# Altium project lvc07a.PrjPcb
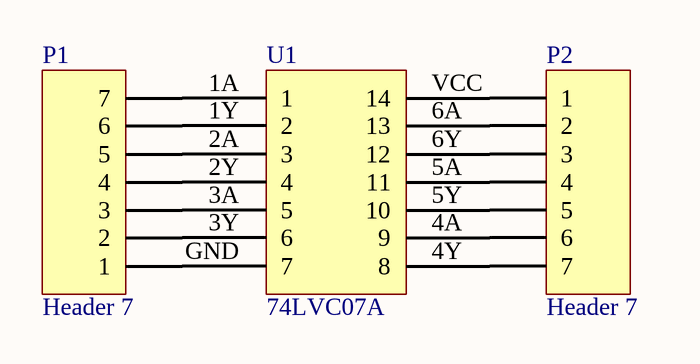
[diagram p0: Sheet1.SchDoc]
1 sheet, 3 parts. Net scope: global (net labels, ports and power ports of the same name join across sheets).
Board file: PCB1.pcbdoc

## Sheet Sheet1.SchDoc
size A4; SheetNumber: 1; SheetTotal: 1

### Parts
P1  Header 7  [HDR1X7]
P2  Header 7  [HDR1X7]
U1  Component_1  [PCBComponent_1]  (value not drawn)

### Nets
NetP1_1: P1.1 U1.GND(7)
NetP1_2: P1.2 U1.3Y(6)
NetP1_3: P1.3 U1.3A(5)
NetP1_4: P1.4 U1.2Y(4)
NetP1_5: P1.5 U1.2A(3)
NetP1_6: P1.6 U1.1Y(2)
NetP1_7: P1.7 U1.1A(1)
NetP2_1: P2.1 U1.VCC(14)
NetP2_2: P2.2 U1.6A(13)
NetP2_3: P2.3 U1.6Y(12)
NetP2_4: P2.4 U1.5A(11)
NetP2_5: P2.5 U1.5Y(10)
NetP2_6: P2.6 U1.4A(9)
NetP2_7: P2.7 U1.4Y(8)

### Notes on the sheet
- (in symbol Component_1) 74LVC07A

### Library data of the parts
P1 P2 = Header 7: Header, 7-Pin; LatestRevisionDate: 17-Jul-2002; LatestRevisionNote: Re-released for DXP Platform.; Publisher: Altium Limited